# Altium schematic sheet Stucture.SchDoc
size 420 x 297 mm; Address1: Address1; Address2: Address2; Address3: Address3; Address4: Address4; DocumentNumber: АБВГ.123456.001 Э3; SheetNumber: 1; Scale: 1:1; DocumentType: Схема электрическая принципиальная; FirstReferrence: АБВГ.123456.001
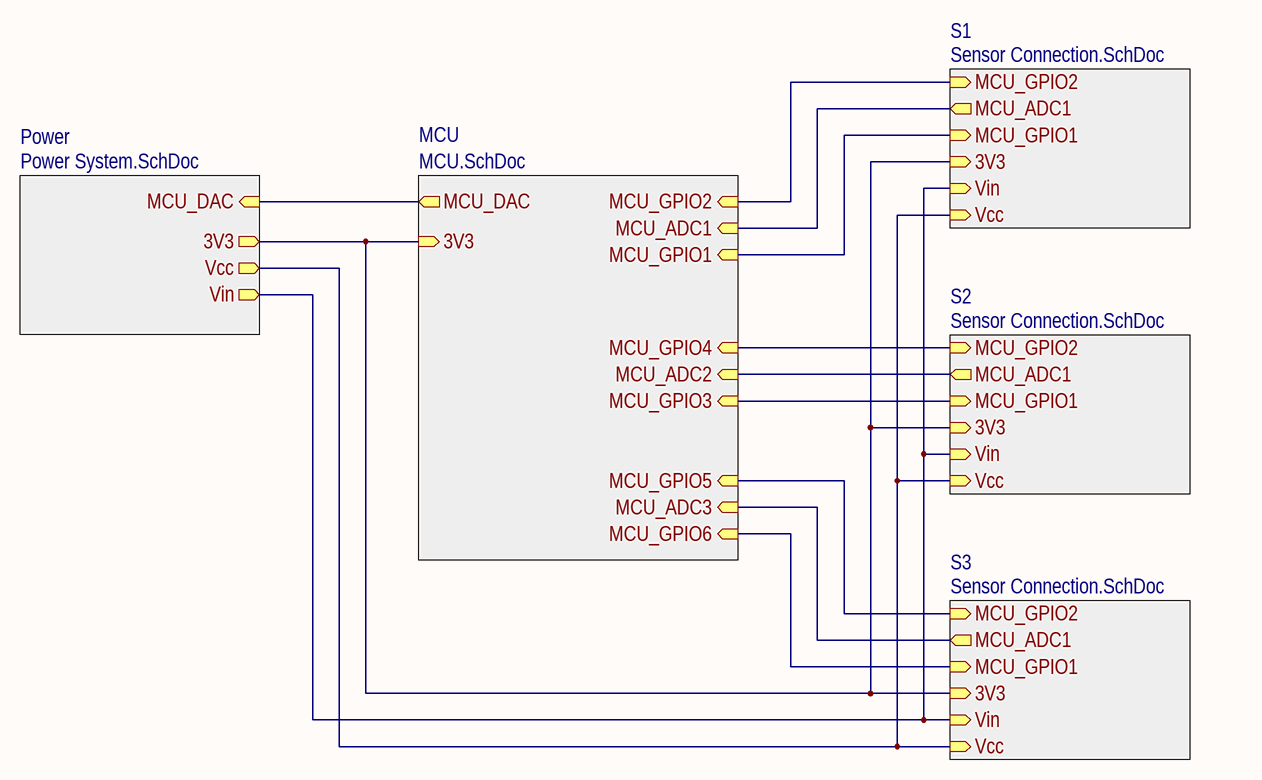
[diagram p0: Stucture.SchDoc]

## Sub-sheets
MCU = MCU.SchDoc: MCU_GPIO5 (in), MCU_GPIO6 (in), MCU_GPIO4 (in), MCU_ADC3 (in), MCU_GPIO1 (in), MCU_ADC1 (in), MCU_ADC2 (in), MCU_DAC (out), 3V3 (in), MCU_GPIO2 (in), MCU_GPIO3 (in)
Power = Power System.SchDoc: MCU_DAC (in), Vcc (out), 3V3 (out), Vin (out)
S1 = Sensor Connection.SchDoc: MCU_GPIO2 (in), MCU_ADC1 (out), MCU_GPIO1 (in), Vcc (in), 3V3 (in), Vin (in)
S2 = Sensor Connection.SchDoc: MCU_GPIO2 (in), MCU_ADC1 (out), MCU_GPIO1 (in), Vcc (in), 3V3 (in), Vin (in)
S3 = Sensor Connection.SchDoc: MCU_GPIO2 (in), MCU_ADC1 (out), MCU_GPIO1 (in), Vcc (in), 3V3 (in), Vin (in)

## Nets
(unnamed): sheet MCU/MCU_GPIO5, sheet S3/MCU_GPIO2
(unnamed): sheet MCU/MCU_GPIO6, sheet S3/MCU_GPIO1
(unnamed): sheet MCU/MCU_GPIO4, sheet S2/MCU_GPIO2
(unnamed): sheet MCU/MCU_ADC3, sheet S3/MCU_ADC1
(unnamed): sheet MCU/MCU_GPIO1, sheet S1/MCU_GPIO1
(unnamed): sheet MCU/MCU_ADC1, sheet S1/MCU_ADC1
(unnamed): sheet MCU/MCU_ADC2, sheet S2/MCU_ADC1
(unnamed): sheet MCU/MCU_DAC, sheet Power/MCU_DAC
(unnamed): sheet MCU/3V3, sheet Power/3V3, sheet S1/3V3, sheet S2/3V3, sheet S3/3V3
(unnamed): sheet MCU/MCU_GPIO2, sheet S1/MCU_GPIO2
(unnamed): sheet MCU/MCU_GPIO3, sheet S2/MCU_GPIO1
(unnamed): sheet Power/Vcc, sheet S1/Vcc, sheet S2/Vcc, sheet S3/Vcc
(unnamed): sheet Power/Vin, sheet S1/Vin, sheet S2/Vin, sheet S3/Vin

## Notes on the sheet
- Перв. примен.
- Справ. №
- Подп. и дата
- Инв. № дубл.
- Взам. инв. №
- Разраб.
- Изм.
- Лист
- № докум.
- Подп.
- Дата
- Лит.
- Масса
- Масштаб
- Пров.
- Т.контр.
- Листов
- Инв. № подл.
- Утв.
- Н.контр.
- 2.106-A3
- Копировал
- Формат А3